# EAGLE design BPU_display-v1d-20inch (EAGLE 9.5.1)
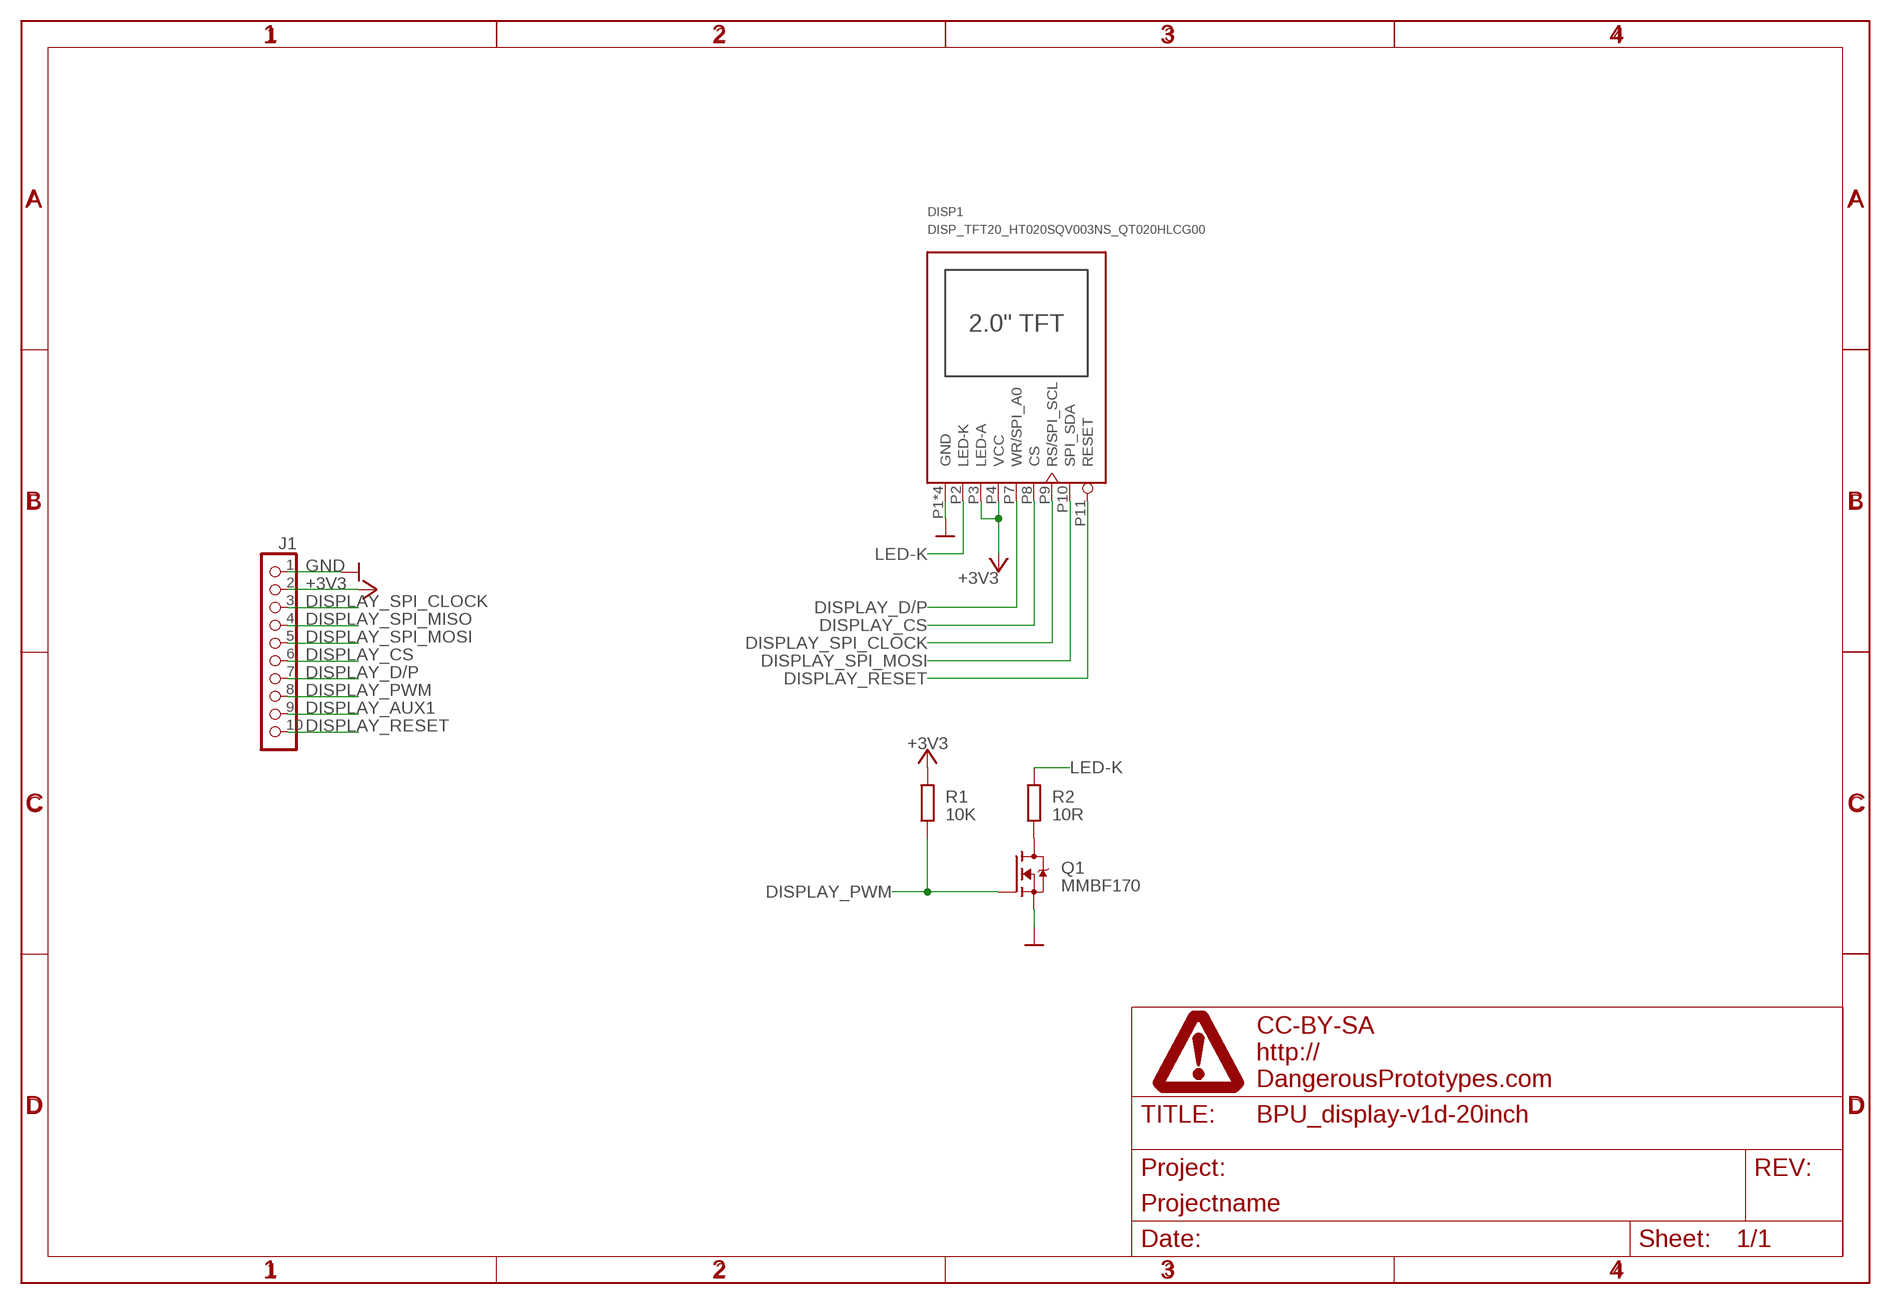
[diagram p0: schematic, sheet 1]

## Parts
DISP1  DISP_TFT20_HT020SQV003NS_QT020HLCG00  [HT020SQV003NS_QT020HLCG00]
J1  CON-FPC_X05B20L10T  [X05B20L10T]
PAGE1  FRAME_DINA4_L  [DP_LOGO]
Q1  MMBF170  TRANSISTOR_FET_BS170-SOT-23  [SOT-23]
R1  10K  R-EU_R0603  [R0603]
R2  10R  R-EU_R0603  [R0603]

## Nets
+3V3: DISP1.P3(LED-A) DISP1.P4(VCC) J1.2 R1.2 ; supply symbol labelled SUPPLY_+3V3
DISPLAY_AUX1: J1.9
DISPLAY_CS: DISP1.P8(CS) J1.6
DISPLAY_D/P: DISP1.P7(WR/SPI_A0) J1.7
DISPLAY_PWM: J1.8 Q1.1(G) R1.1
DISPLAY_RESET [signal_digital]: DISP1.P11(RESET) J1.10
DISPLAY_SPI_CLOCK: DISP1.P9(RS/SPI_SCL) J1.3
DISPLAY_SPI_MISO: J1.4
DISPLAY_SPI_MOSI: DISP1.P10(SPI_SDA) J1.5
GND: DISP1.P1(GND) DISP1.P5(GND) DISP1.P6(GND) DISP1.P12(GND) J1.1 Q1.2(S) ; supply symbol labelled SUPPLY_GND
LED-K: DISP1.P2(LED-K) R2.2
N$2: Q1.3(D) R2.1

## Library data of the parts
DISP1 = dp_devices.v6:DISP_TFT20_HT020SQV003NS_QT020HLCG00: 2 in 1 2.0" TFT display, HT020SQV003NS and QT020HLCG00
J1 = dp_devices.v6:CON-FPC_X05B20L10T: 10-pin 0.5mm pitch SMD FPC Connector X05B20L10T
PAGE1 = dp_devices.v6:FRAME_DINA4_L: A4 DP frame Standard Dangerous Prototypes schematic frame. Automagically adds the DP logo and standard texts to the PCB Use the atrribute in the schematic editor to change the fields.; FF1: fulfillment by; FF2: Seeed Studio; FF3: www.seeedstudio.com; LICENSE: CC-BY-SA; PROJECT: Projectname; URL1: http://; URL2: DangerousPrototypes.com
Q1 = dp_devices.v6:TRANSISTOR_FET_BS170: N-Channel Enhancement Mode Field Effect Transistor
R1 R2 = rcl:R-EU_: RESISTOR, European symbol; SPICEPREFIX: R

## Net classes
1 power: width 0.305 mm
3 signal_digital: width 0.254 mm

## Board
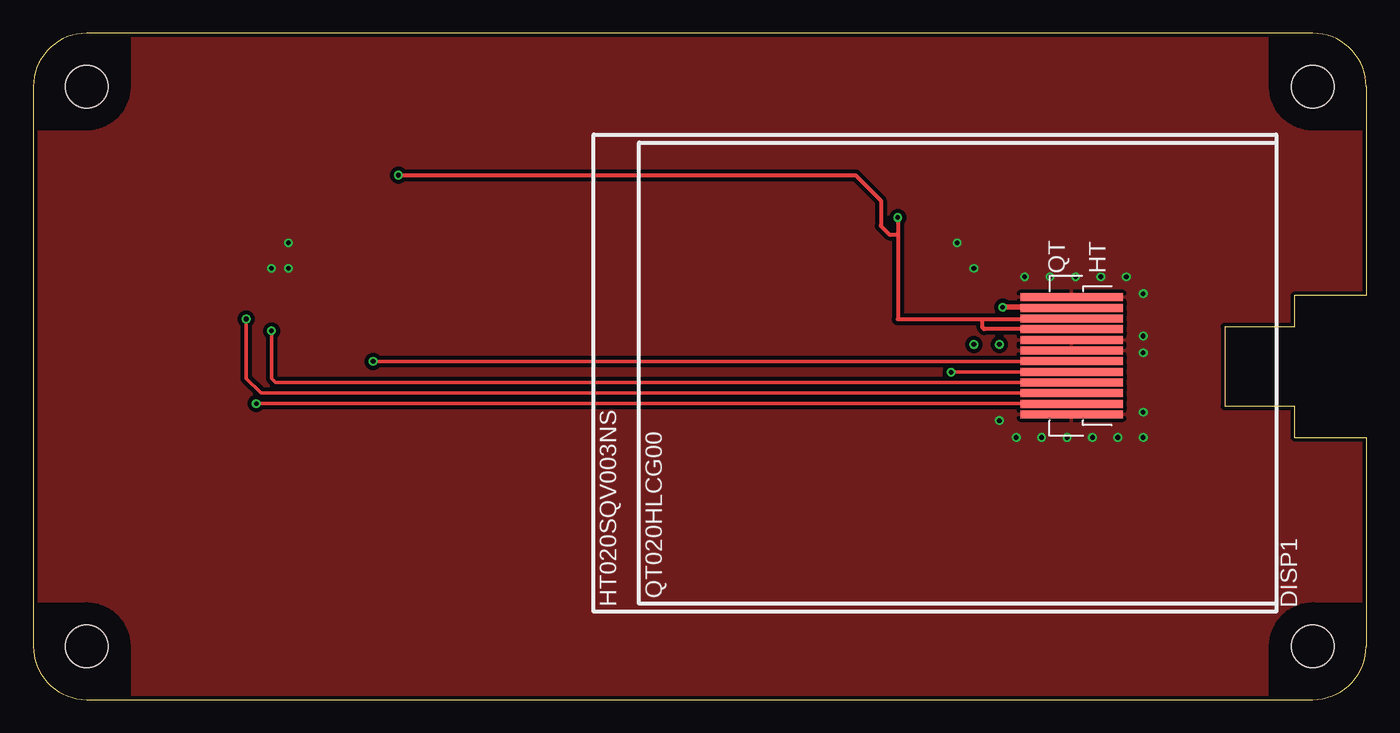
[diagram p1: board, top side]
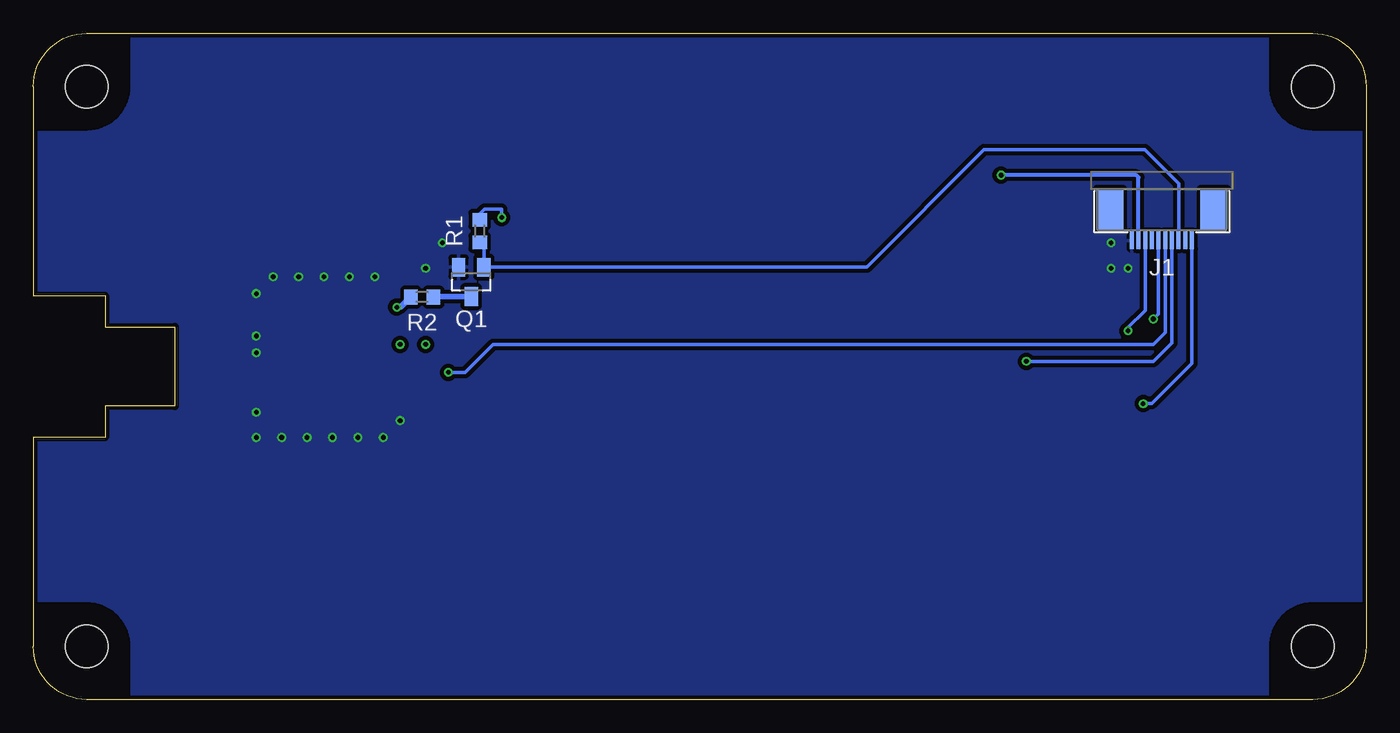
[diagram p2: board, bottom side, seen from below]

Size 100 x 50 mm. Coordinates in mm from the lower left corner, seen from the top.
Outline: 99.99,46 99.99,30.31 94.61,30.31 94.61,27.98 89.38,27.98 89.38,22.02 94.61,22.02 94.61,19.69 99.99,19.69 99.99,4
Outline: 100,46 arc90 96,50 4,50 arc90 0,46 0,4 arc90 4,0 96,0 arc90 100,4
Copper layers (1*16): Top 0.035mm / dielectric 1.5mm / Bottom 0.035mm
Design rules "dirt_cheap_dirty_boards.v1.1": minimum track width 6mil, minimum drill 12mil, track to track 6mil, track to pad 6mil, pad to pad 6mil, via to via 6mil, smd to smd 0mil, copper to edge 10mil, drill to drill 10mil, minimum pad ring 10mil, minimum via ring 6mil, stop-mask expansion 2mil, vias tented up to drill 25mil, thermal gap 10mil
Holes 3.2 mm at 4,4 96,4 96,46 4,46
tKeepout: 8 lines
bKeepout: 8 lines
tRestrict: area 0,43 to 7,50; area 93,43 to 100,50; area 0,0 to 7,7; area 93,0 to 100,7
bRestrict: area 0,43 to 7,50; area 93,43 to 100,50; area 0,0 to 7,7; area 93,0 to 100,7
vRestrict: area 113.9,82.8 to 120.9,89.8; area 206.9,82.8 to 213.9,89.8; area 113.9,39.8 to 120.9,46.8; area 206.9,39.8 to 213.9,46.8

### Footprints (pad centres in the part's own frame; a part is rotated, then mirrored left to right if it is on the bottom)
HT020SQV003NS_QT020HLCG00 = smd 0.6 x 7.7: P1 5.7,-10.25; P2 4.9,-10.25; P3 4.1,-10.25; P4 3.3,-10.25; P5 2.5,-10.25; P6 1.7,-10.25; P7 0.9,-10.25; P8 0.1,-10.25; P9 -0.7,-10.25; P10 -1.5,-10.25; P11 -2.3,-10.25; P12 -3.1,-10.25
X05B20L10T = smd 0.3 x 1.3: 1 2.25,2.35; 2 1.75,2.35; 3 1.25,2.35; 4 0.75,2.35; 5 0.25,2.35; 6 -0.25,2.35; 7 -0.75,2.35; 8 -1.25,2.35; 9 -1.75,2.35; 10 -2.25,2.35 | smd 2 x 3: 11 -3.9,0; 12 3.9,0
SOT-23 = smd 1 x 1.4: 1 -0.95,-1.1; 2 0.95,-1.1; 3 0,1.1
R0603 = smd 1 x 1.1: 1 -0.85,0; 2 0.85,0

### Placement (x,y rotation side)
DISP1  67.65,24.5 90 top
J1  15.33,36.81 180 bottom
PAGE1  36.66,0.24 0 top
Q1  67.14,31.35 180 bottom
R1  66.51,35.16 90 bottom
R2  70.83,30.21 180 bottom

### Tracks (layer width: path | path; a pad name or v marks a point on that pad's centre or on a via)
+3V3  (via drill 0.35)
  Top 0.254: 77.86,28.56 DISP1.P3
  Top 0.305: v64.86,36.18 64.86,34.91 | 64.86,34.91 64.86,28.56 71.21,28.56 | 71.21,28.56 77.86,28.56 | DISP1.P4 71.33,27.8 71.21,27.92 71.21,28.56 | v27.39,39.35 61.68,39.35 63.59,37.45 63.59,35.54 64.22,34.91 64.86,34.91
  Bottom 0.254: R1.2 66.51,36.43 66.13,36.81 64.86,36.81 v64.86,36.18
  Bottom 0.305: J1.2 17.08,39.2 17.23,39.35 v27.39,39.35
DISPLAY_CS  (via drill 0.35)
  Top 0.254: DISP1.P8 68.94,24.6 68.92,24.62 v68.86,24.56
  Bottom 0.254: J1.6 15.08,27.54 15.96,26.65 65.49,26.65 66.13,26.02 67.59,24.56 v68.86,24.56
DISPLAY_D/P  (via drill 0.35)
  Top 0.254: v25.49,25.38 77.88,25.38 DISP1.P7
  Bottom 0.254: J1.7 14.58,26.77 15.96,25.38 v25.49,25.38
DISPLAY_PWM
  Bottom 0.254: R1.1 66.19,34 Q1.1 37.47,32.45 28.66,41.26 16.6,41.26 14.06,38.72 14.06,34.48 J1.8
DISPLAY_RESET  (via drill 0.35)
  Top 0.254: DISP1.P11 v16.73,22.21
  Bottom 0.254: J1.10 13.08,25.22 16.09,22.21 v16.73,22.21
DISPLAY_SPI_CLOCK  (via drill 0.35)
  Top 0.254: v17.87,27.67 17.87,24.11 18.18,23.8 DISP1.P9
  Bottom 0.254: J1.3 16.58,29.21 17.87,27.92 v17.87,27.67
DISPLAY_SPI_MOSI  (via drill 0.35)
  Top 0.254: DISP1.P10 17.08,23 15.96,24.11 v15.96,28.56
  Bottom 0.254: v15.96,28.56 15.58,28.94 J1.5
GND  (via drill 0.35)
  other vias: 19.14,34.27 19.14,32.37 17.87,32.37 69.3,34.27 70.57,32.37 74.38,31.73 76.29,31.73 78.19,31.73 80.1,31.73 82,31.73 83.27,30.46 83.27,27.29 83.27,26.02 83.27,21.57 83.27,19.67 72.48,20.94 73.75,19.67 75.65,19.67 77.56,19.67 79.46,19.67 81.37,19.67
  pour Top (isolate 0.305, rank 6): -0.32,50.25 99.99,50.25 99.99,-0.26 -0.32,-0.26
  pour Bottom (isolate 0.305, rank 6): -0.32,50.25 99.99,50.25 99.99,-0.26 -0.32,-0.26
LED-K  (via drill 0.35)
  Top 0.406: DISP1.P2 77.85,29.45 v72.73,29.45
  Bottom 0.406: R2.2 72.44,29.45 v72.73,29.45
N$2
  Bottom 0.406: R2.1 69.81,30.04 69.59,30.25 Q1.3
N$8  (via drill 0.35)
  other vias: 72.48,26.65
N$9  (via drill 0.35)
  other vias: 70.57,26.65

### Text on the board
Measures: 100mm | 50mm | 4.0mm | D = 3.2mm | R = 4.0mm
Reference: Center | Center